# EAGLE schematic sensor-board (EAGLE 6.5.0)
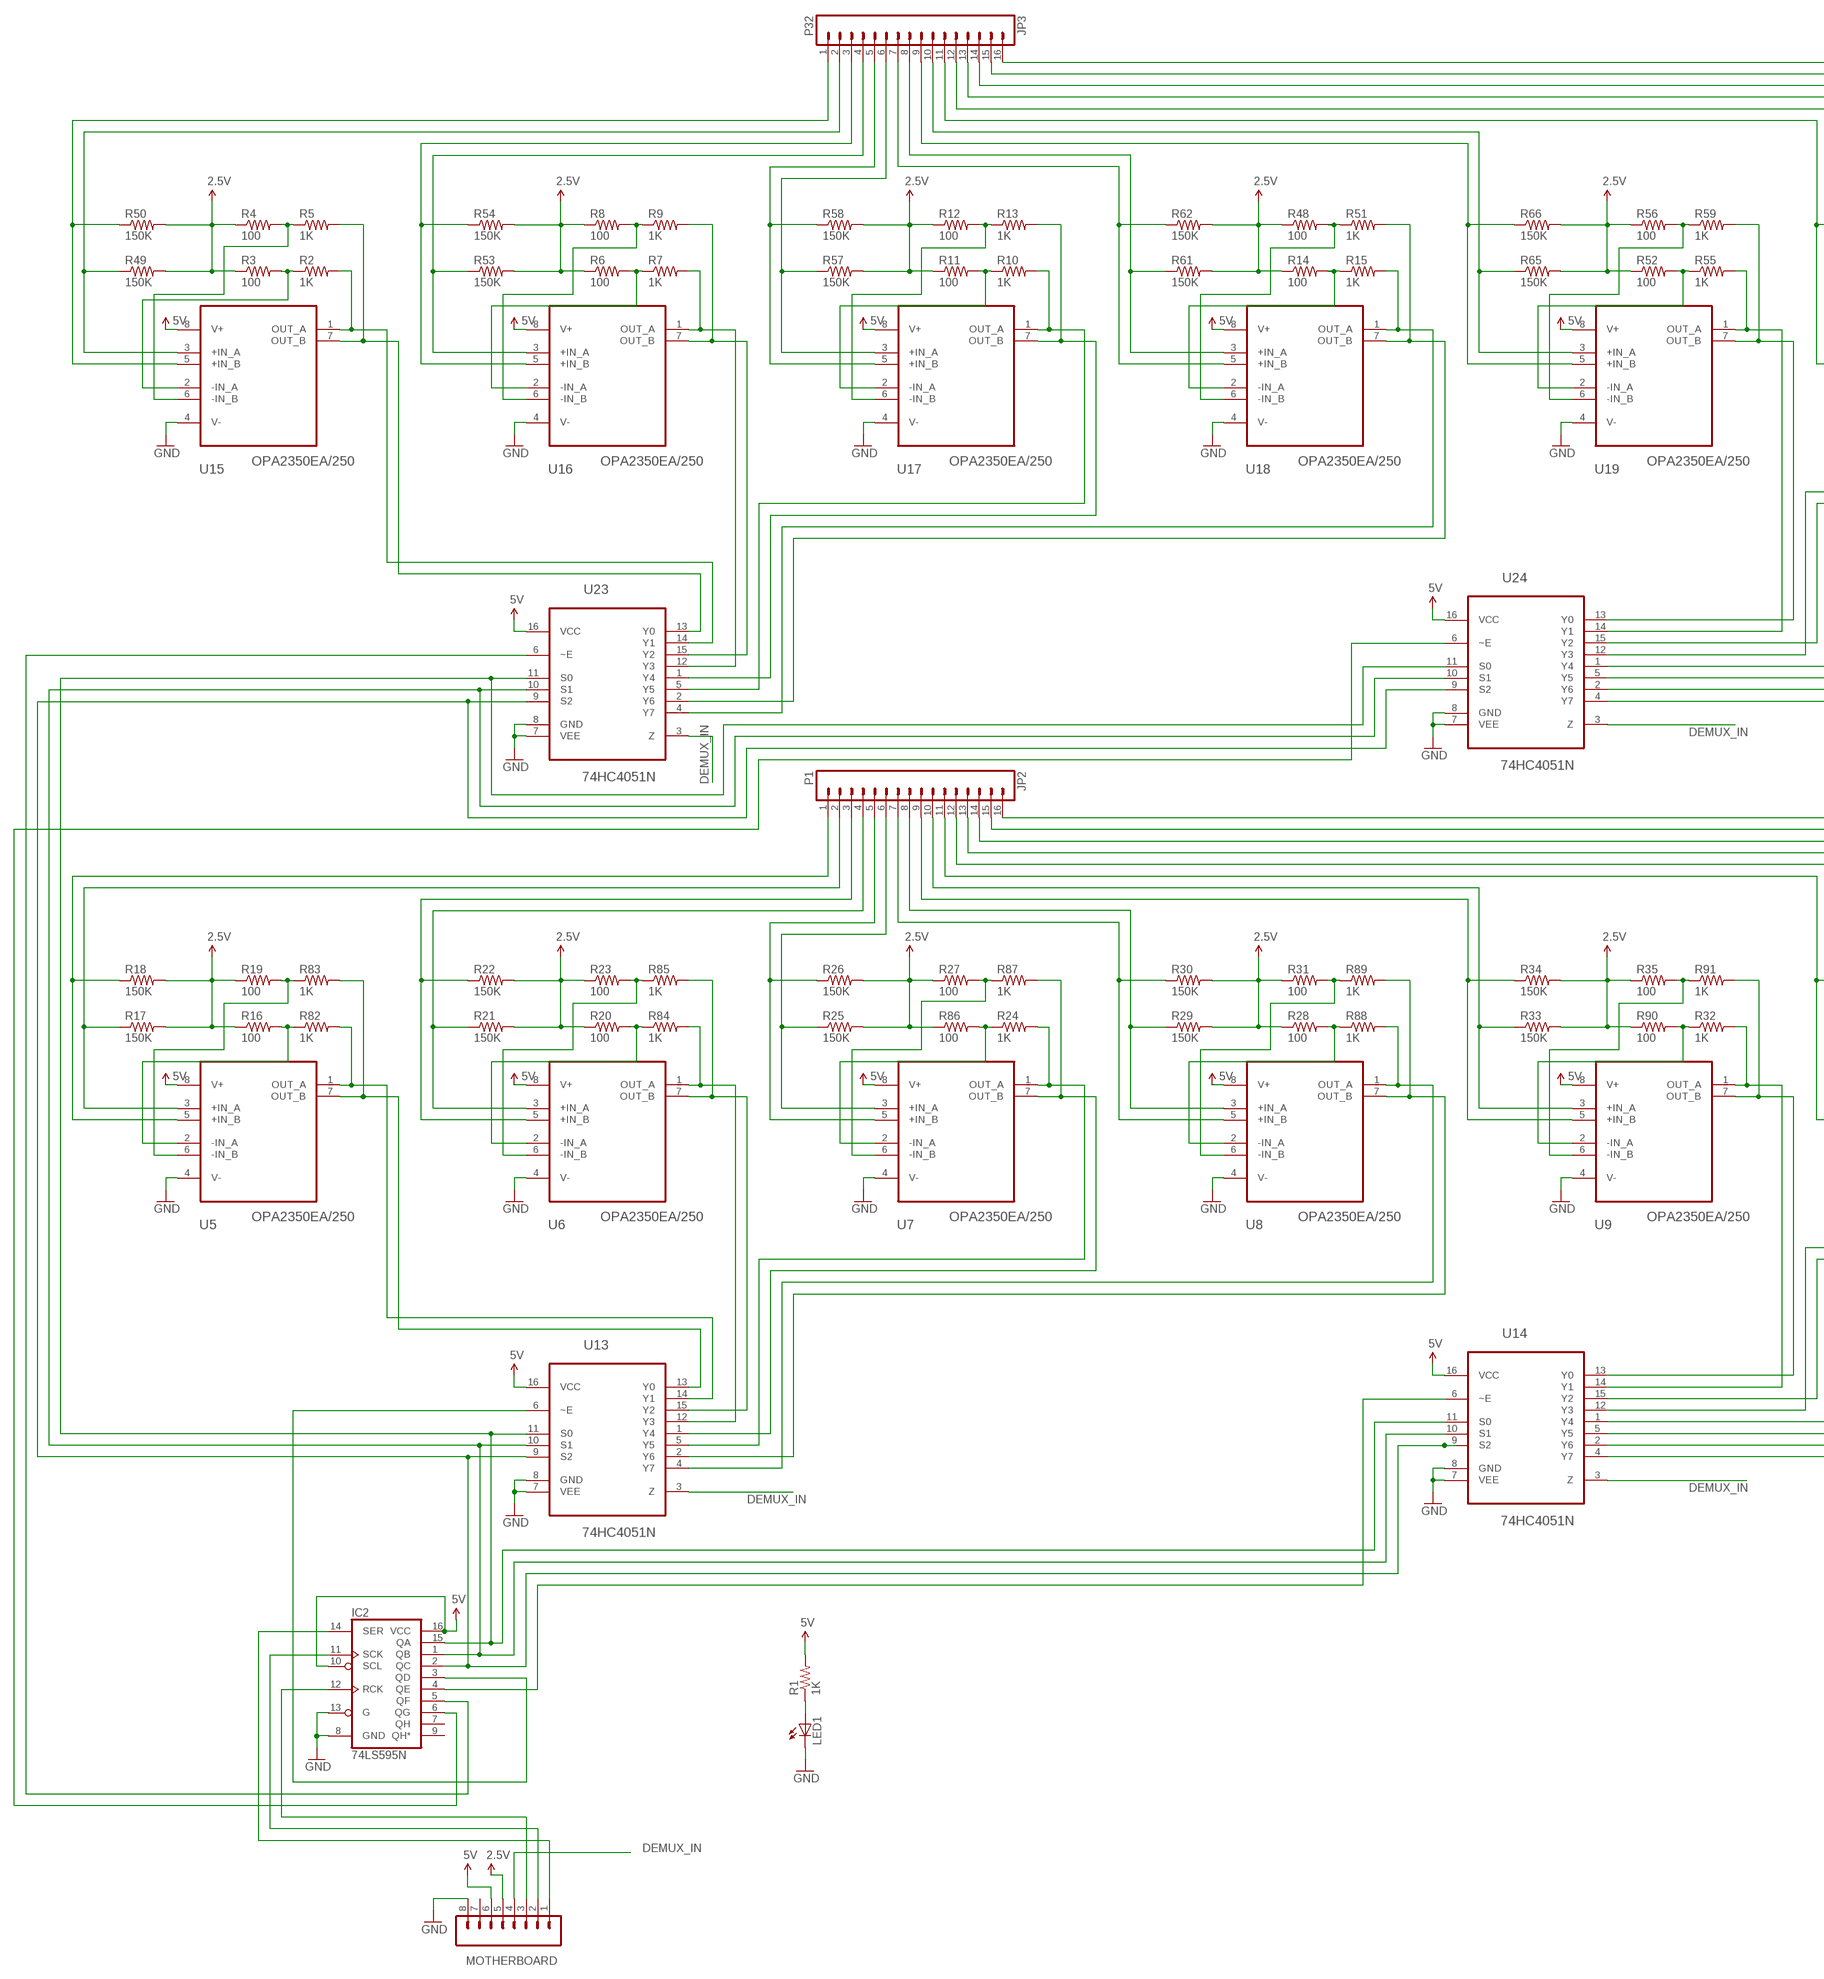
[diagram p0: schematic, sheet 1, part 1 of 2]
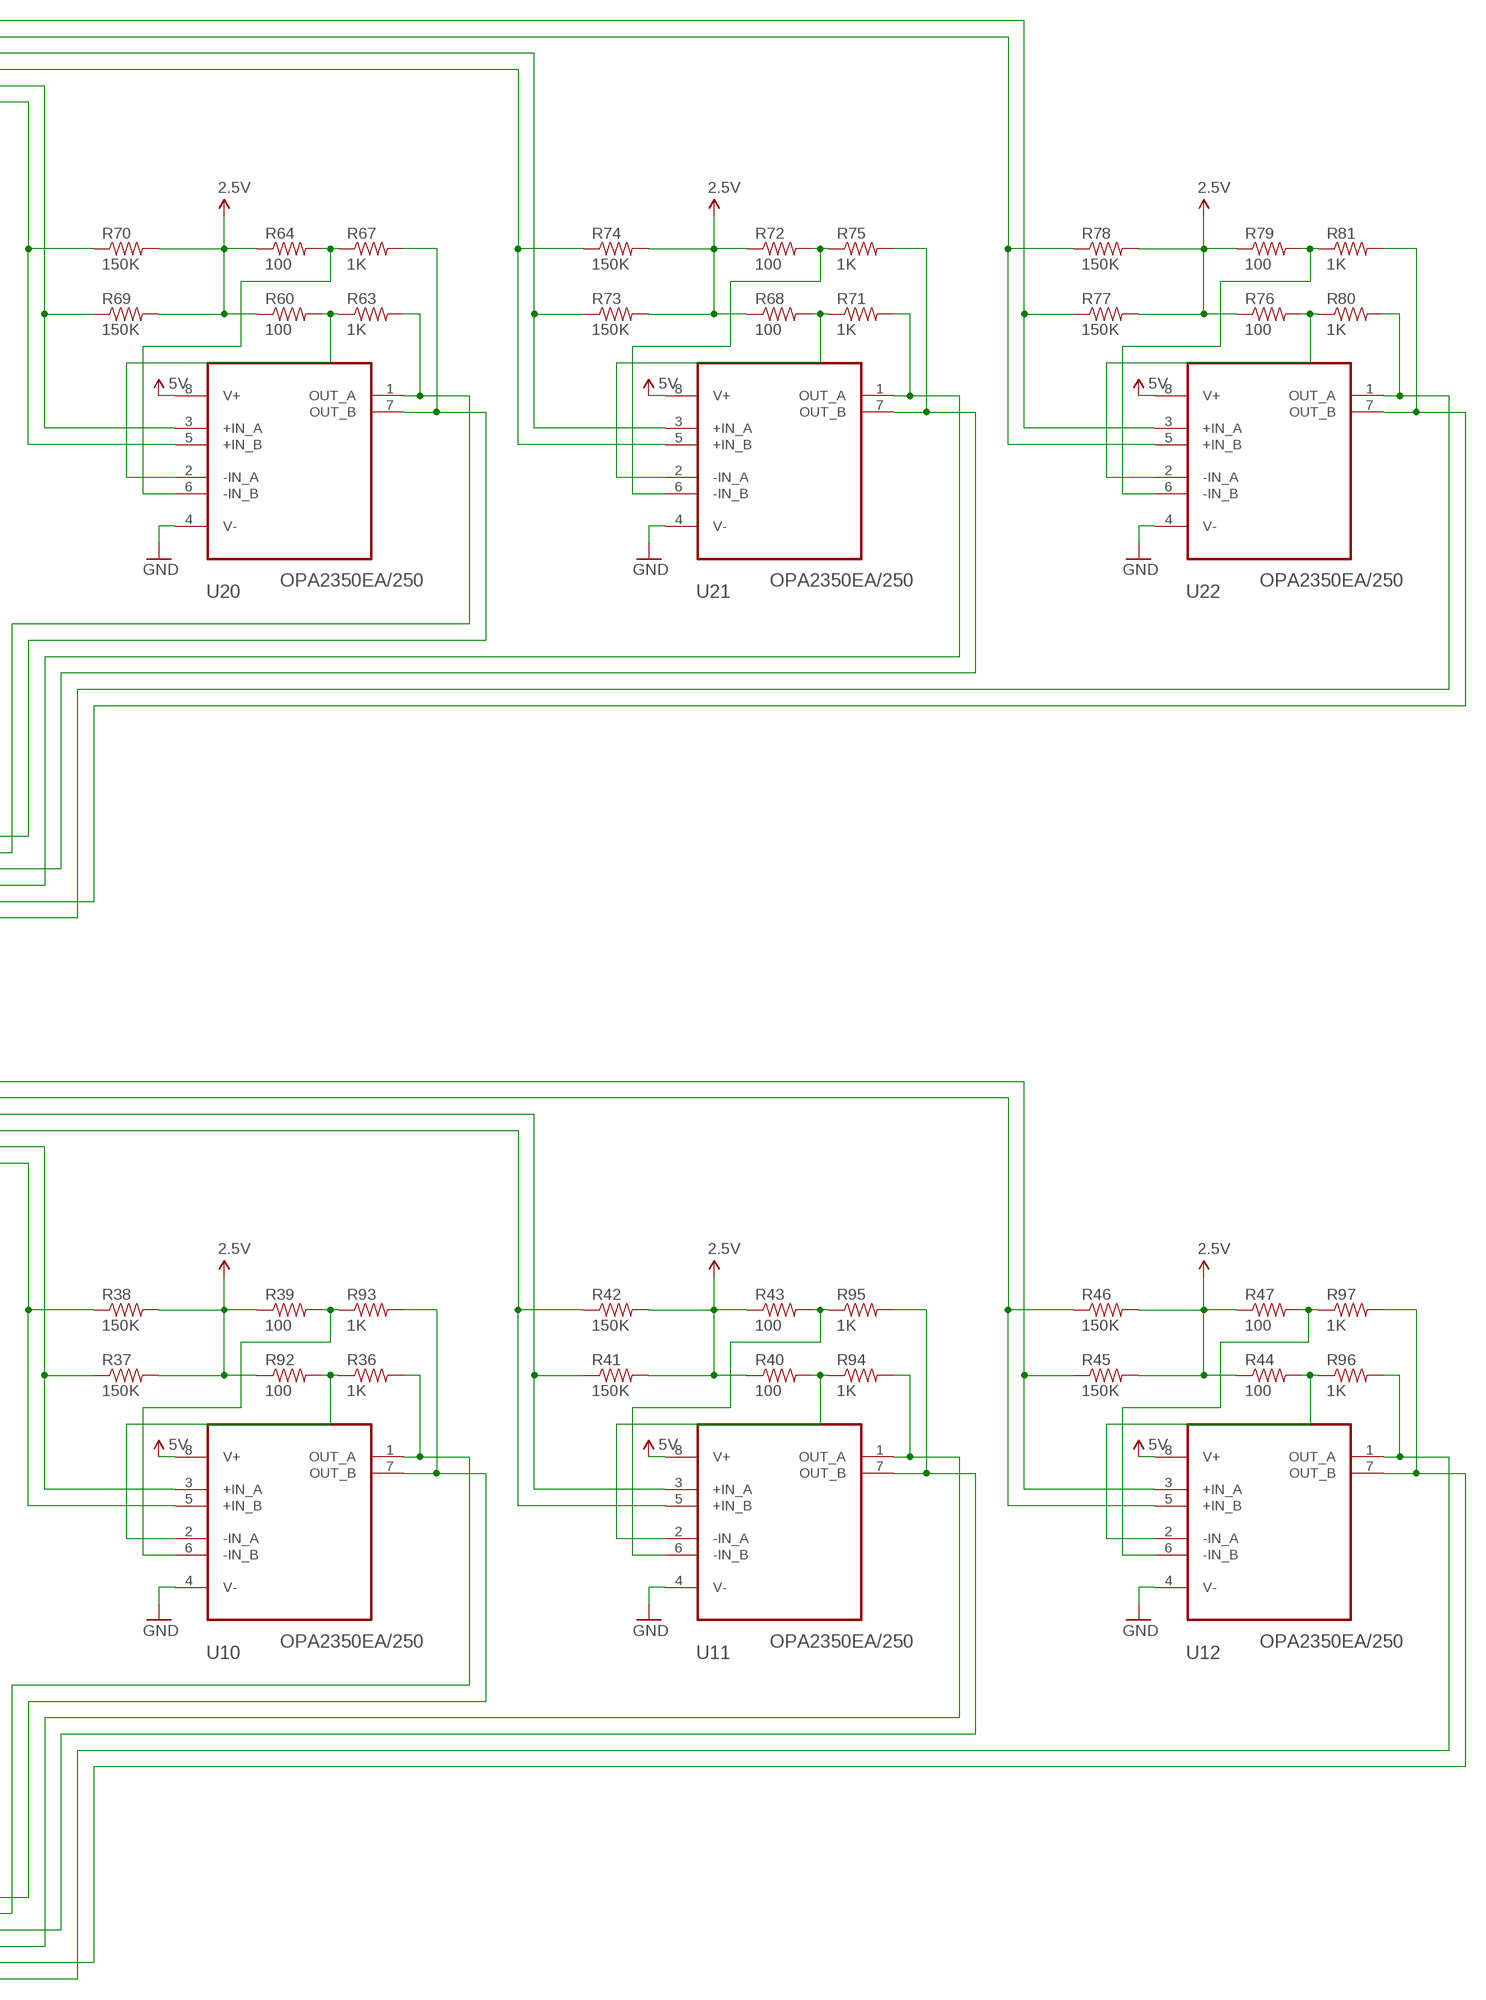
[diagram p1: schematic, sheet 1, part 2 of 2]

## Parts
IC2  74LS595N  [DIL16]
JP2  P1  M16LOCK  [1X16_LOCK]
JP3  P32  M16LOCK  [1X16_LOCK]
LED1  LED0603  [LED-0603]
MOTHERBOARD  M08LONGPADS  [1X08_LONGPADS]
R1  1K  RESISTOR0805-RES  [0805]
R2  1K  RESISTOR0805-RES  [0805]
R3  100  RESISTOR0805-RES  [0805]
R4  100  RESISTOR0805-RES  [0805]
R5  1K  RESISTOR0805-RES  [0805]
R6  100  RESISTOR0805-RES  [0805]
R7  1K  RESISTOR0805-RES  [0805]
R8  100  RESISTOR0805-RES  [0805]
R9  1K  RESISTOR0805-RES  [0805]
R10  1K  RESISTOR0805-RES  [0805]
R11  100  RESISTOR0805-RES  [0805]
R12  100  RESISTOR0805-RES  [0805]
R13  1K  RESISTOR0805-RES  [0805]
R14  100  RESISTOR0805-RES  [0805]
R15  1K  RESISTOR0805-RES  [0805]
R16  100  RESISTOR0805-RES  [0805]
R17  150K  RESISTOR0805-RES  [0805]
R18  150K  RESISTOR0805-RES  [0805]
R19  100  RESISTOR0805-RES  [0805]
R20  100  RESISTOR0805-RES  [0805]
R21  150K  RESISTOR0805-RES  [0805]
R22  150K  RESISTOR0805-RES  [0805]
R23  100  RESISTOR0805-RES  [0805]
R24  1K  RESISTOR0805-RES  [0805]
R25  150K  RESISTOR0805-RES  [0805]
R26  150K  RESISTOR0805-RES  [0805]
R27  100  RESISTOR0805-RES  [0805]
R28  100  RESISTOR0805-RES  [0805]
R29  150K  RESISTOR0805-RES  [0805]
R30  150K  RESISTOR0805-RES  [0805]
R31  100  RESISTOR0805-RES  [0805]
R32  1K  RESISTOR0805-RES  [0805]
R33  150K  RESISTOR0805-RES  [0805]
R34  150K  RESISTOR0805-RES  [0805]
R35  100  RESISTOR0805-RES  [0805]
R36  1K  RESISTOR0805-RES  [0805]
R37  150K  RESISTOR0805-RES  [0805]
R38  150K  RESISTOR0805-RES  [0805]
R39  100  RESISTOR0805-RES  [0805]
R40  100  RESISTOR0805-RES  [0805]
R41  150K  RESISTOR0805-RES  [0805]
R42  150K  RESISTOR0805-RES  [0805]
R43  100  RESISTOR0805-RES  [0805]
R44  100  RESISTOR0805-RES  [0805]
R45  150K  RESISTOR0805-RES  [0805]
R46  150K  RESISTOR0805-RES  [0805]
R47  100  RESISTOR0805-RES  [0805]
R48  100  RESISTOR0805-RES  [0805]
R49  150K  RESISTOR0805-RES  [0805]
R50  150K  RESISTOR0805-RES  [0805]
R51  1K  RESISTOR0805-RES  [0805]
R52  100  RESISTOR0805-RES  [0805]
R53  150K  RESISTOR0805-RES  [0805]
R54  150K  RESISTOR0805-RES  [0805]
R55  1K  RESISTOR0805-RES  [0805]
R56  100  RESISTOR0805-RES  [0805]
R57  150K  RESISTOR0805-RES  [0805]
R58  150K  RESISTOR0805-RES  [0805]
R59  1K  RESISTOR0805-RES  [0805]
R60  100  RESISTOR0805-RES  [0805]
R61  150K  RESISTOR0805-RES  [0805]
R62  150K  RESISTOR0805-RES  [0805]
R63  1K  RESISTOR0805-RES  [0805]
R64  100  RESISTOR0805-RES  [0805]
R65  150K  RESISTOR0805-RES  [0805]
R66  150K  RESISTOR0805-RES  [0805]
R67  1K  RESISTOR0805-RES  [0805]
R68  100  RESISTOR0805-RES  [0805]
R69  150K  RESISTOR0805-RES  [0805]
R70  150K  RESISTOR0805-RES  [0805]
R71  1K  RESISTOR0805-RES  [0805]
R72  100  RESISTOR0805-RES  [0805]
R73  150K  RESISTOR0805-RES  [0805]
R74  150K  RESISTOR0805-RES  [0805]
R75  1K  RESISTOR0805-RES  [0805]
R76  100  RESISTOR0805-RES  [0805]
R77  150K  RESISTOR0805-RES  [0805]
R78  150K  RESISTOR0805-RES  [0805]
R79  100  RESISTOR0805-RES  [0805]
R80  1K  RESISTOR0805-RES  [0805]
R81  1K  RESISTOR0805-RES  [0805]
R82  1K  RESISTOR0805-RES  [0805]
R83  1K  RESISTOR0805-RES  [0805]
R84  1K  RESISTOR0805-RES  [0805]
R85  1K  RESISTOR0805-RES  [0805]
R86  100  RESISTOR0805-RES  [0805]
R87  1K  RESISTOR0805-RES  [0805]
R88  1K  RESISTOR0805-RES  [0805]
R89  1K  RESISTOR0805-RES  [0805]
R90  100  RESISTOR0805-RES  [0805]
R91  1K  RESISTOR0805-RES  [0805]
R92  100  RESISTOR0805-RES  [0805]
R93  1K  RESISTOR0805-RES  [0805]
R94  1K  RESISTOR0805-RES  [0805]
R95  1K  RESISTOR0805-RES  [0805]
R96  1K  RESISTOR0805-RES  [0805]
R97  1K  RESISTOR0805-RES  [0805]
U5  OPA2350EA/250  [SOP65P490X110-8N]
U6  OPA2350EA/250  [SOP65P490X110-8N]
U7  OPA2350EA/250  [SOP65P490X110-8N]
U8  OPA2350EA/250  [SOP65P490X110-8N]
U9  OPA2350EA/250  [SOP65P490X110-8N]
U10  OPA2350EA/250  [SOP65P490X110-8N]
U11  OPA2350EA/250  [SOP65P490X110-8N]
U12  OPA2350EA/250  [SOP65P490X110-8N]
U13  74HC4051N  [DIP254P762X420-16]
U14  74HC4051N  [DIP254P762X420-16]
U15  OPA2350EA/250  [SOP65P490X110-8N]
U16  OPA2350EA/250  [SOP65P490X110-8N]
U17  OPA2350EA/250  [SOP65P490X110-8N]
U18  OPA2350EA/250  [SOP65P490X110-8N]
U19  OPA2350EA/250  [SOP65P490X110-8N]
U20  OPA2350EA/250  [SOP65P490X110-8N]
U21  OPA2350EA/250  [SOP65P490X110-8N]
U22  OPA2350EA/250  [SOP65P490X110-8N]
U23  74HC4051N  [DIP254P762X420-16]
U24  74HC4051N  [DIP254P762X420-16]

## Nets
2.8V: MOTHERBOARD.5 R3.1 R4.1 R6.1 R8.1 R11.1 R12.1 R14.1 R16.1 R17.2 R18.2 R19.1 R20.1 R21.2 R22.2 R23.1 R25.2 R26.2 R27.1 R28.1 R29.2 R30.2 R31.1 R33.2 R34.2 R35.1 R37.2 R38.2 R39.1 R40.1 R41.2 R42.2 R43.1 R44.1 R45.2 R46.2 R47.1 R48.1 R49.2 R50.2 R52.1 R53.2 R54.2 R56.1 R57.2 R58.2 R60.1 R61.2 R62.2 R64.1 R65.2 R66.2 R68.1 R69.2 R70.2 R72.1 R73.2 R74.2 R76.1 R77.2 R78.2 R79.1 R86.1 R90.1 R92.1 ; supply symbol labelled 2.5V
5V: IC2.10(SCL) IC2.16(VCC) MOTHERBOARD.6 R1.2 U5.8(V+) U6.8(V+) U7.8(V+) U8.8(V+) U9.8(V+) U10.8(V+) U11.8(V+) U12.8(V+) U13.16(VCC) U14.16(VCC) U15.8(V+) U16.8(V+) U17.8(V+) U18.8(V+) U19.8(V+) U20.8(V+) U21.8(V+) U22.8(V+) U23.16(VCC) U24.16(VCC)
DEMUX_IN: MOTHERBOARD.4 U13.3(Z) U14.3(Z) U23.3(Z) U24.3(Z)
GND: IC2.8(GND) IC2.13(G) LED1.C MOTHERBOARD.8 U5.4(V-) U6.4(V-) U7.4(V-) U8.4(V-) U9.4(V-) U10.4(V-) U11.4(V-) U12.4(V-) U13.7(VEE) U13.8(GND) U14.7(VEE) U14.8(GND) U15.4(V-) U16.4(V-) U17.4(V-) U18.4(V-) U19.4(V-) U20.4(V-) U21.4(V-) U22.4(V-) U23.7(VEE) U23.8(GND) U24.7(VEE) U24.8(GND)
N$1: LED1.A R1.1
N$2: R2.1 R3.2 U15.2(-IN_A)
N$3: R4.2 R5.1 U15.6(-IN_B)
N$4: R6.2 R7.1 U16.2(-IN_A)
N$5: R8.2 R9.1 U16.6(-IN_B)
N$6: R10.1 R11.2 U17.2(-IN_A)
N$7: R12.2 R13.1 U17.6(-IN_B)
N$8: R14.2 R15.1 U18.2(-IN_A)
N$9: R48.2 R51.1 U18.6(-IN_B)
N$10: R52.2 R55.1 U19.2(-IN_A)
N$11: R56.2 R59.1 U19.6(-IN_B)
N$12: R60.2 R63.1 U20.2(-IN_A)
N$13: R64.2 R67.1 U20.6(-IN_B)
N$14: R68.2 R71.1 U21.2(-IN_A)
N$15: R72.2 R75.1 U21.6(-IN_B)
N$16: R76.2 R80.1 U22.2(-IN_A)
N$17: R79.2 R81.1 U22.6(-IN_B)
N$18: R16.2 R82.1 U5.2(-IN_A)
N$19: R19.2 R83.1 U5.6(-IN_B)
N$20: R20.2 R84.1 U6.2(-IN_A)
N$21: R23.2 R85.1 U6.6(-IN_B)
N$22: R24.1 R86.2 U7.2(-IN_A)
N$23: R27.2 R87.1 U7.6(-IN_B)
N$24: R82.2 U5.1(OUT_A) U13.14(Y1)
N$25: R83.2 U5.7(OUT_B) U13.13(Y0)
N$26: R84.2 U6.1(OUT_A) U13.12(Y3)
N$27: R28.2 R88.1 U8.2(-IN_A)
N$28: JP2.2 R17.1 U5.3(+IN_A)
N$29: JP2.1 R18.1 U5.5(+IN_B)
N$30: R31.2 R89.1 U8.6(-IN_B)
N$31: R85.2 U6.7(OUT_B) U13.15(Y2)
N$32: R32.1 R90.2 U9.2(-IN_A)
N$33: JP2.4 R21.1 U6.3(+IN_A)
N$34: JP2.3 R22.1 U6.5(+IN_B)
N$35: R35.2 R91.1 U9.6(-IN_B)
N$36: R24.2 U7.1(OUT_A) U13.5(Y5)
N$37: R87.2 U7.7(OUT_B) U13.1(Y4)
N$38: R36.1 R92.2 U10.2(-IN_A)
N$39: JP2.6 R25.1 U7.3(+IN_A)
N$40: JP2.5 R26.1 U7.5(+IN_B)
N$41: R39.2 R93.1 U10.6(-IN_B)
N$42: R88.2 U8.1(OUT_A) U13.4(Y7)
N$43: R89.2 U8.7(OUT_B) U13.2(Y6)
N$44: R40.2 R94.1 U11.2(-IN_A)
N$45: R32.2 U9.1(OUT_A) U14.14(Y1)
N$46: JP2.7 R30.1 U8.5(+IN_B)
N$47: R44.2 R96.1 U12.2(-IN_A)
N$48: JP2.8 R29.1 U8.3(+IN_A)
N$49: R91.2 U9.7(OUT_B) U14.13(Y0)
N$50: R47.2 R97.1 U12.6(-IN_B)
N$51: JP2.9 R34.1 U9.5(+IN_B)
N$53: JP2.10 R33.1 U9.3(+IN_A)
N$54: R36.2 U10.1(OUT_A) U14.12(Y3)
N$55: R93.2 U10.7(OUT_B) U14.15(Y2)
N$57: JP2.11 R38.1 U10.5(+IN_B)
N$59: JP2.12 R37.1 U10.3(+IN_A)
N$60: R94.2 U11.1(OUT_A) U14.5(Y5)
N$61: R95.2 U11.7(OUT_B) U14.1(Y4)
N$63: JP2.13 R42.1 U11.5(+IN_B)
N$64: R43.2 R95.1 U11.6(-IN_B)
N$65: JP2.14 R41.1 U11.3(+IN_A)
N$66: R96.2 U12.1(OUT_A) U14.4(Y7)
N$67: R97.2 U12.7(OUT_B) U14.2(Y6)
N$69: JP2.15 R46.1 U12.5(+IN_B)
N$71: JP2.16 R45.1 U12.3(+IN_A)
N$72: R2.2 U15.1(OUT_A) U23.14(Y1)
N$73: IC2.15(QA) U13.11(S0) U14.11(S0) U23.11(S0) U24.11(S0)
N$74: IC2.1(QB) U13.10(S1) U14.10(S1) U23.10(S1) U24.10(S1)
N$75: IC2.2(QC) U13.9(S2) U14.9(S2) U23.9(S2) U24.9(S2)
N$76: IC2.3(QD) U13.6(~E)
N$77: IC2.4(QE) U14.6(~E)
N$78: R5.2 U15.7(OUT_B) U23.13(Y0)
N$80: JP3.2 R49.1 U15.3(+IN_A)
N$81: JP3.1 R50.1 U15.5(+IN_B)
N$83: R7.2 U16.1(OUT_A) U23.12(Y3)
N$84: R9.2 U16.7(OUT_B) U23.15(Y2)
N$86: JP3.4 R53.1 U16.3(+IN_A)
N$87: JP3.3 R54.1 U16.5(+IN_B)
N$89: R10.2 U17.1(OUT_A) U23.5(Y5)
N$90: R13.2 U17.7(OUT_B) U23.1(Y4)
N$92: JP3.6 R57.1 U17.3(+IN_A)
N$93: JP3.5 R58.1 U17.5(+IN_B)
N$95: R15.2 U18.1(OUT_A) U23.4(Y7)
N$96: R51.2 U18.7(OUT_B) U23.2(Y6)
N$98: JP3.7 R62.1 U18.5(+IN_B)
N$100: JP3.8 R61.1 U18.3(+IN_A)
N$101: R55.2 U19.1(OUT_A) U24.14(Y1)
N$102: R59.2 U19.7(OUT_B) U24.13(Y0)
N$104: JP3.9 R66.1 U19.5(+IN_B)
N$106: JP3.10 R65.1 U19.3(+IN_A)
N$107: R63.2 U20.1(OUT_A) U24.12(Y3)
N$108: R67.2 U20.7(OUT_B) U24.15(Y2)
N$110: JP3.11 R70.1 U20.5(+IN_B)
N$112: JP3.12 R69.1 U20.3(+IN_A)
N$113: R71.2 U21.1(OUT_A) U24.5(Y5)
N$114: R75.2 U21.7(OUT_B) U24.1(Y4)
N$116: JP3.13 R74.1 U21.5(+IN_B)
N$118: JP3.14 R73.1 U21.3(+IN_A)
N$119: R80.2 U22.1(OUT_A) U24.4(Y7)
N$120: R81.2 U22.7(OUT_B) U24.2(Y6)
N$122: JP3.15 R78.1 U22.5(+IN_B)
N$124: JP3.16 R77.1 U22.3(+IN_A)
N$125: IC2.5(QF) U23.6(~E)
N$126: IC2.6(QG) U24.6(~E)
N$127: IC2.12(RCK) MOTHERBOARD.3
SHIFT_CLK: IC2.11(SCK) MOTHERBOARD.2
SHIFT_SER: IC2.14(SER) MOTHERBOARD.1
Unconnected: IC2.7(QH) IC2.9(QH*) MOTHERBOARD.7

## Library data of the parts
IC2 = SparkFun-DigitalIC:74*595: 8-bit SHIFT REGISTER, output latch
JP2 JP3 = SparkFun-Connectors:M16: 1x16 .1" header
LED1 = SparkFun-LED:LED: LEDs Standard schematic elements and footprints for 5mm, 3mm, 1206, and 0603 sized LEDs. 5mm - Spark Fun Electronics SKU : COM-00529 (and others)
MOTHERBOARD = SparkFun-Connectors:M08: Header 8 Standard 8-pin 0.1" header. Use with straight break away headers (SKU : PRT-00116), right angle break away headers (PRT-00553), swiss pins (PRT-00743), machine pins (PRT-00117), and female headers (PRT-00115).
R1-R97 = SparkFun-Passives:RESISTOR: Resistor Basic schematic elements and footprints for 0603, 1206, and PTH resistors.
U5-U12 U15-U22 = gkaindl:OPA2350EA/250: OPERATIONAL AMPLIFIERS; MPN: OPA2350EA/250; OC_FARNELL: 1459568; OC_NEWARK: 74K3902; PACKAGE: MSOP-8; SUPPLIER: Texas Instruments
U13 U14 U23 U24 = gkaindl:74HC4051N: 8-channel analog multiplexer/demultiplexer; MPN: 74HC4051N; OC_FARNELL: 380910; OC_NEWARK: 07WX3738; PACKAGE: DIP-16; SUPPLIER: NXP